# EAGLE schematic RSS (EAGLE 6.5.0)
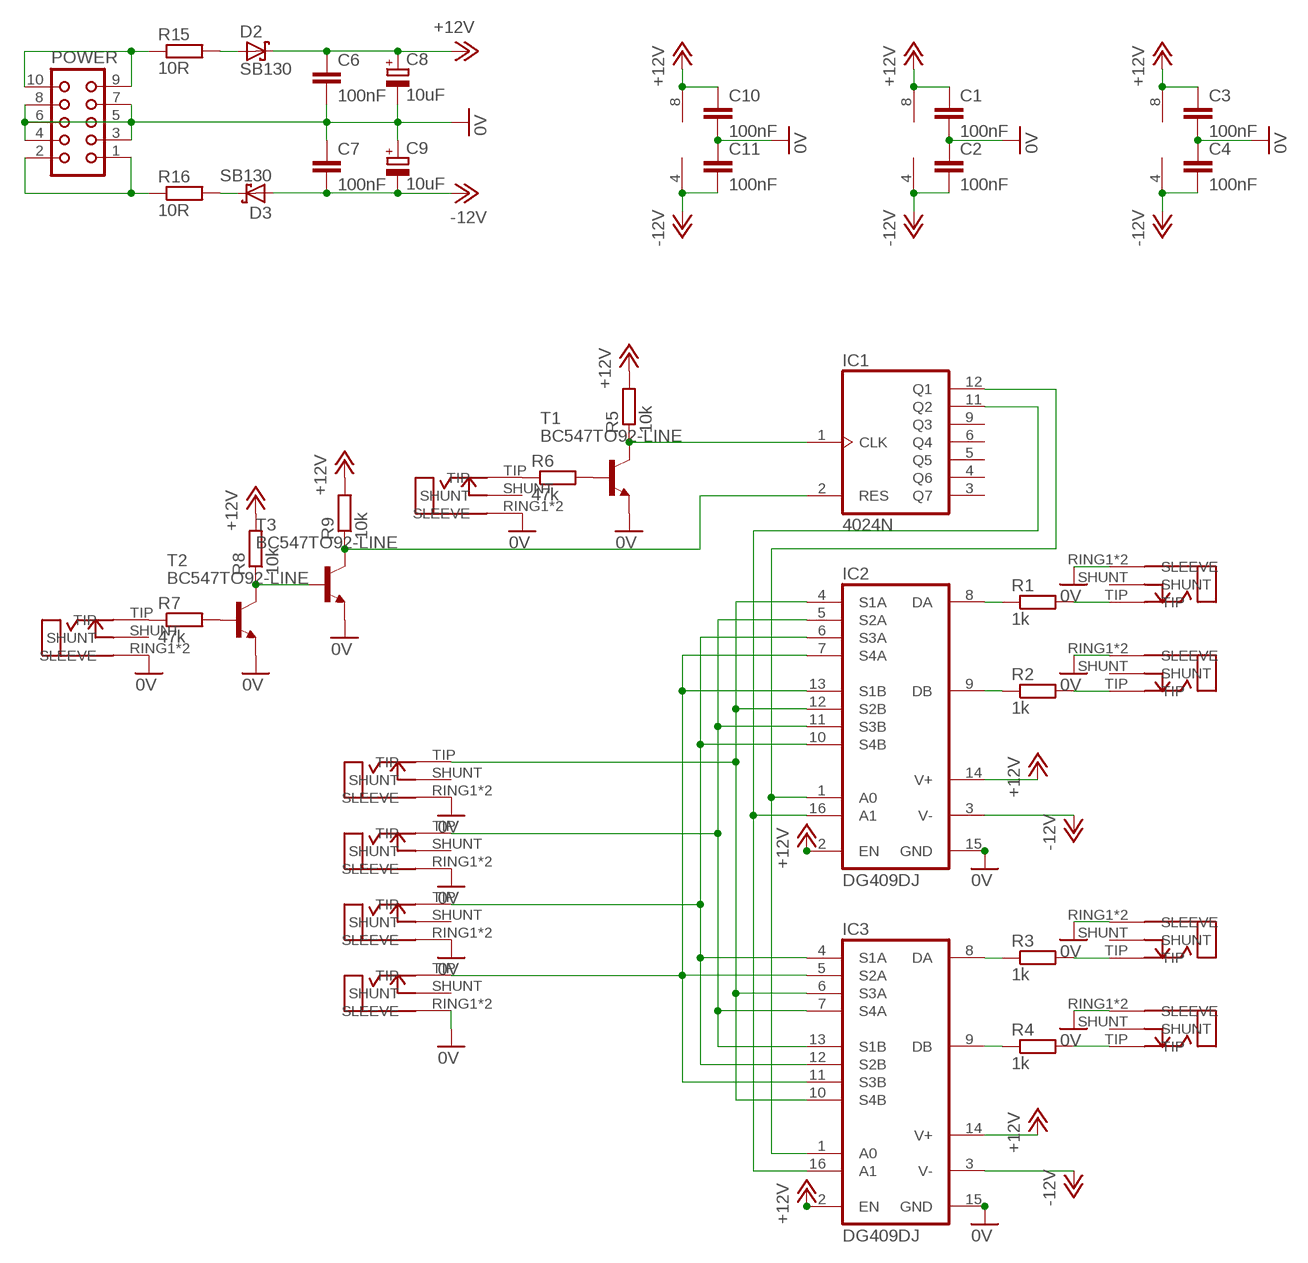
[diagram p0: schematic, sheet 1]

## Parts
C1  100nF  C-EU025-024X044  [C025-024X044]
C2  100nF  C-EU025-024X044  [C025-024X044]
C3  100nF  C-EU025-024X044  [C025-024X044]
C4  100nF  C-EU025-024X044  [C025-024X044]
C6  100nF  C-EU025-024X044  [C025-024X044]
C7  100nF  C-EU025-024X044  [C025-024X044]
C8  10uF  CPOL-EUE2-5  [E2-5]
C9  10uF  CPOL-EUE2-5  [E2-5]
C10  100nF  C-EU025-024X044  [C025-024X044]
C11  100nF  C-EU025-024X044  [C025-024X044]
CLOCK  ERTHENVAR_3.5MM_JACKHOLES  [ERTHENVAR]
D2  SB130  SB130DO-204AL  [DO41-7]
D3  SB130  SB130DO-204AL  [DO41-7]
I/O1  ERTHENVAR_3.5MM_JACKHOLES  [ERTHENVAR]
I/O2  ERTHENVAR_3.5MM_JACKHOLES  [ERTHENVAR]
I/O3  ERTHENVAR_3.5MM_JACKHOLES  [ERTHENVAR]
I/O4  ERTHENVAR_3.5MM_JACKHOLES  [ERTHENVAR]
IC1  4024N  [DIL14]
IC2  DG409DJ  [DIL16]
IC3  DG409DJ  [DIL16]
IC4  TL072  TL072P  [DIL08]
IC5  TL072  TL072P  [DIL08]
IC6  TL072  TL072P  [DIL08]
O/I1  ERTHENVAR_3.5MM_JACKHOLES  [ERTHENVAR]
O/I2  ERTHENVAR_3.5MM_JACKHOLES  [ERTHENVAR]
O/I3  ERTHENVAR_3.5MM_JACKHOLES  [ERTHENVAR]
O/I4  ERTHENVAR_3.5MM_JACKHOLES  [ERTHENVAR]
POWER  CON10L  [CON10L]
R1  1k  R-EU_0207/10  [0207/9]
R2  1k  R-EU_0207/10  [0207/9]
R3  1k  R-EU_0207/10  [0207/9]
R4  1k  R-EU_0207/10  [0207/9]
R5  10k  R-EU_0207/10  [0207/9]
R6  47k  R-EU_0207/10  [0207/9]
R7  47k  R-EU_0207/10  [0207/9]
R8  10k  R-EU_0207/10  [0207/9]
R9  10k  R-EU_0207/10  [0207/9]
R15  10R  R-EU_0207/10  [0207/9]
R16  10R  R-EU_0207/10  [0207/9]
SYNC/RESET  ERTHENVAR_3.5MM_JACKHOLES  [ERTHENVAR]
T1  BC547TO92-LINE  [TO92-LINE]
T2  BC547TO92-LINE  [TO92-LINE]
T3  BC547TO92-LINE  [TO92-LINE]

## Nets
0V: C1.2 C2.1 C3.2 C4.1 C6.2 C7.1 C8.- C9.+ C10.2 C11.1 CLOCK.RING1(SLEEVE) CLOCK.RING2(SLEEVE) I/O1.RING1(SLEEVE) I/O1.RING2(SLEEVE) I/O2.RING1(SLEEVE) I/O2.RING2(SLEEVE) I/O3.RING1(SLEEVE) I/O3.RING2(SLEEVE) I/O4.RING1(SLEEVE) I/O4.RING2(SLEEVE) IC2.15(GND) IC3.15(GND) O/I1.RING1(SLEEVE) O/I1.RING2(SLEEVE) O/I2.RING1(SLEEVE) O/I2.RING2(SLEEVE) O/I3.RING1(SLEEVE) O/I3.RING2(SLEEVE) O/I4.RING1(SLEEVE) O/I4.RING2(SLEEVE) POWER.3 POWER.4 POWER.5 POWER.6 POWER.7 POWER.8 SYNC/RESET.RING1(SLEEVE) SYNC/RESET.RING2(SLEEVE) T1.1(E) T2.1(E) T3.1(E)
+12V: C1.1 C3.1 C6.1 C8.+ C10.1 D2.C IC2.2(EN) IC2.14(V+) IC3.2(EN) IC3.14(V+) IC4.8(P:V+) IC5.8(P:V+) IC6.8(P:V+) R5.2 R8.2 R9.2
-12V: C2.2 C4.2 C7.2 C9.- C11.2 D3.A IC2.3(V-) IC3.3(V-) IC4.4(P:V-) IC5.4(P:V-) IC6.4(P:V-)
N$1: IC1.11(Q2) IC2.16(A1) IC3.16(A1)
N$2: IC1.12(Q1) IC2.1(A0) IC3.1(A0)
N$3: IC2.4(S1A) IC2.12(S2B) IC3.6(S3A) IC3.10(S4B) O/I1.TIP
N$4: IC2.5(S2A) IC2.11(S3B) IC3.7(S4A) IC3.13(S1B) O/I2.TIP
N$5: IC2.6(S3A) IC2.10(S4B) IC3.4(S1A) IC3.12(S2B) O/I3.TIP
N$6: IC2.7(S4A) IC2.13(S1B) IC3.5(S2A) IC3.11(S3B) O/I4.TIP
N$7: I/O4.TIP R4.2
N$8: IC3.9(DB) R4.1
N$9: IC3.8(DA) R3.1
N$10: I/O3.TIP R3.2
N$11: I/O2.TIP R2.2
N$12: IC2.9(DB) R2.1
N$13: IC2.8(DA) R1.1
N$14: I/O1.TIP R1.2
N$15: IC1.1(CLK) R5.1 T1.3(C)
N$16: R6.2 T1.2(B)
N$17: CLOCK.TIP R6.1
N$18: R7.1 SYNC/RESET.TIP
N$19: R7.2 T2.2(B)
N$20: R8.1 T2.3(C) T3.2(B)
N$21: IC1.2(RES) R9.1 T3.3(C)
N$22: POWER.1 POWER.2 R16.1
N$23: POWER.9 POWER.10 R15.1
N$24: D2.A R15.2
N$25: D3.C R16.2
Unconnected: CLOCK.SHUNT I/O1.SHUNT I/O2.SHUNT I/O3.SHUNT I/O4.SHUNT IC1.3(Q7) IC1.4(Q6) IC1.5(Q5) IC1.6(Q4) IC1.9(Q3) IC4.1(A:OUT) IC4.2(A:-IN) IC4.3(A:+IN) IC4.5(B:+IN) IC4.6(B:-IN) IC4.7(B:OUT) IC5.1(A:OUT) IC5.2(A:-IN) IC5.3(A:+IN) IC5.5(B:+IN) IC5.6(B:-IN) IC5.7(B:OUT) IC6.1(A:OUT) IC6.2(A:-IN) IC6.3(A:+IN) IC6.5(B:+IN) IC6.6(B:-IN) IC6.7(B:OUT) O/I1.SHUNT O/I2.SHUNT O/I3.SHUNT O/I4.SHUNT SYNC/RESET.SHUNT

## Power pins joined to a net without a drawn wire
VDD: IC1.14(VDD)
VSS: IC1.7(VSS)

## Library data of the parts
C1-C4 C6 C7 C10 C11 = Roll Your Own:C-EU: CAPACITOR, European symbol
C8 C9 = Roll Your Own:CPOL-EU: POLARIZED CAPACITOR, European symbol
CLOCK I/O1-I/O4 O/I1-O/I4 SYNC/RESET = Roll Your Own:ERTHENVAR_3.5MM_JACK
D2 D3 = Roll Your Own:SB130
IC1 = 40xx:4024: 7-stage binary/ripple COUNTER
IC2 IC3 = maxim:DG409DJ: ANALOG MULTIPLEXER; MF: INTERSIL; MPN: DG409DJ; OC_FARNELL: 9664084; OC_NEWARK: 06F3963
IC4-IC6 = Roll Your Own:TL072: OP AMP
POWER = Roll Your Own:CON10L: CONNECTOR; OC_FARNELL: unknown; OC_NEWARK: unknown
R1-R9 R15 R16 = Roll Your Own:R-EU_: RESISTOR, European symbol
T1-T3 = Roll Your Own:BC547: NPN TRANSISTOR